# EAGLE design SparkFun BabyBuck Regulator - AP63203 (EAGLE 9.6.2)
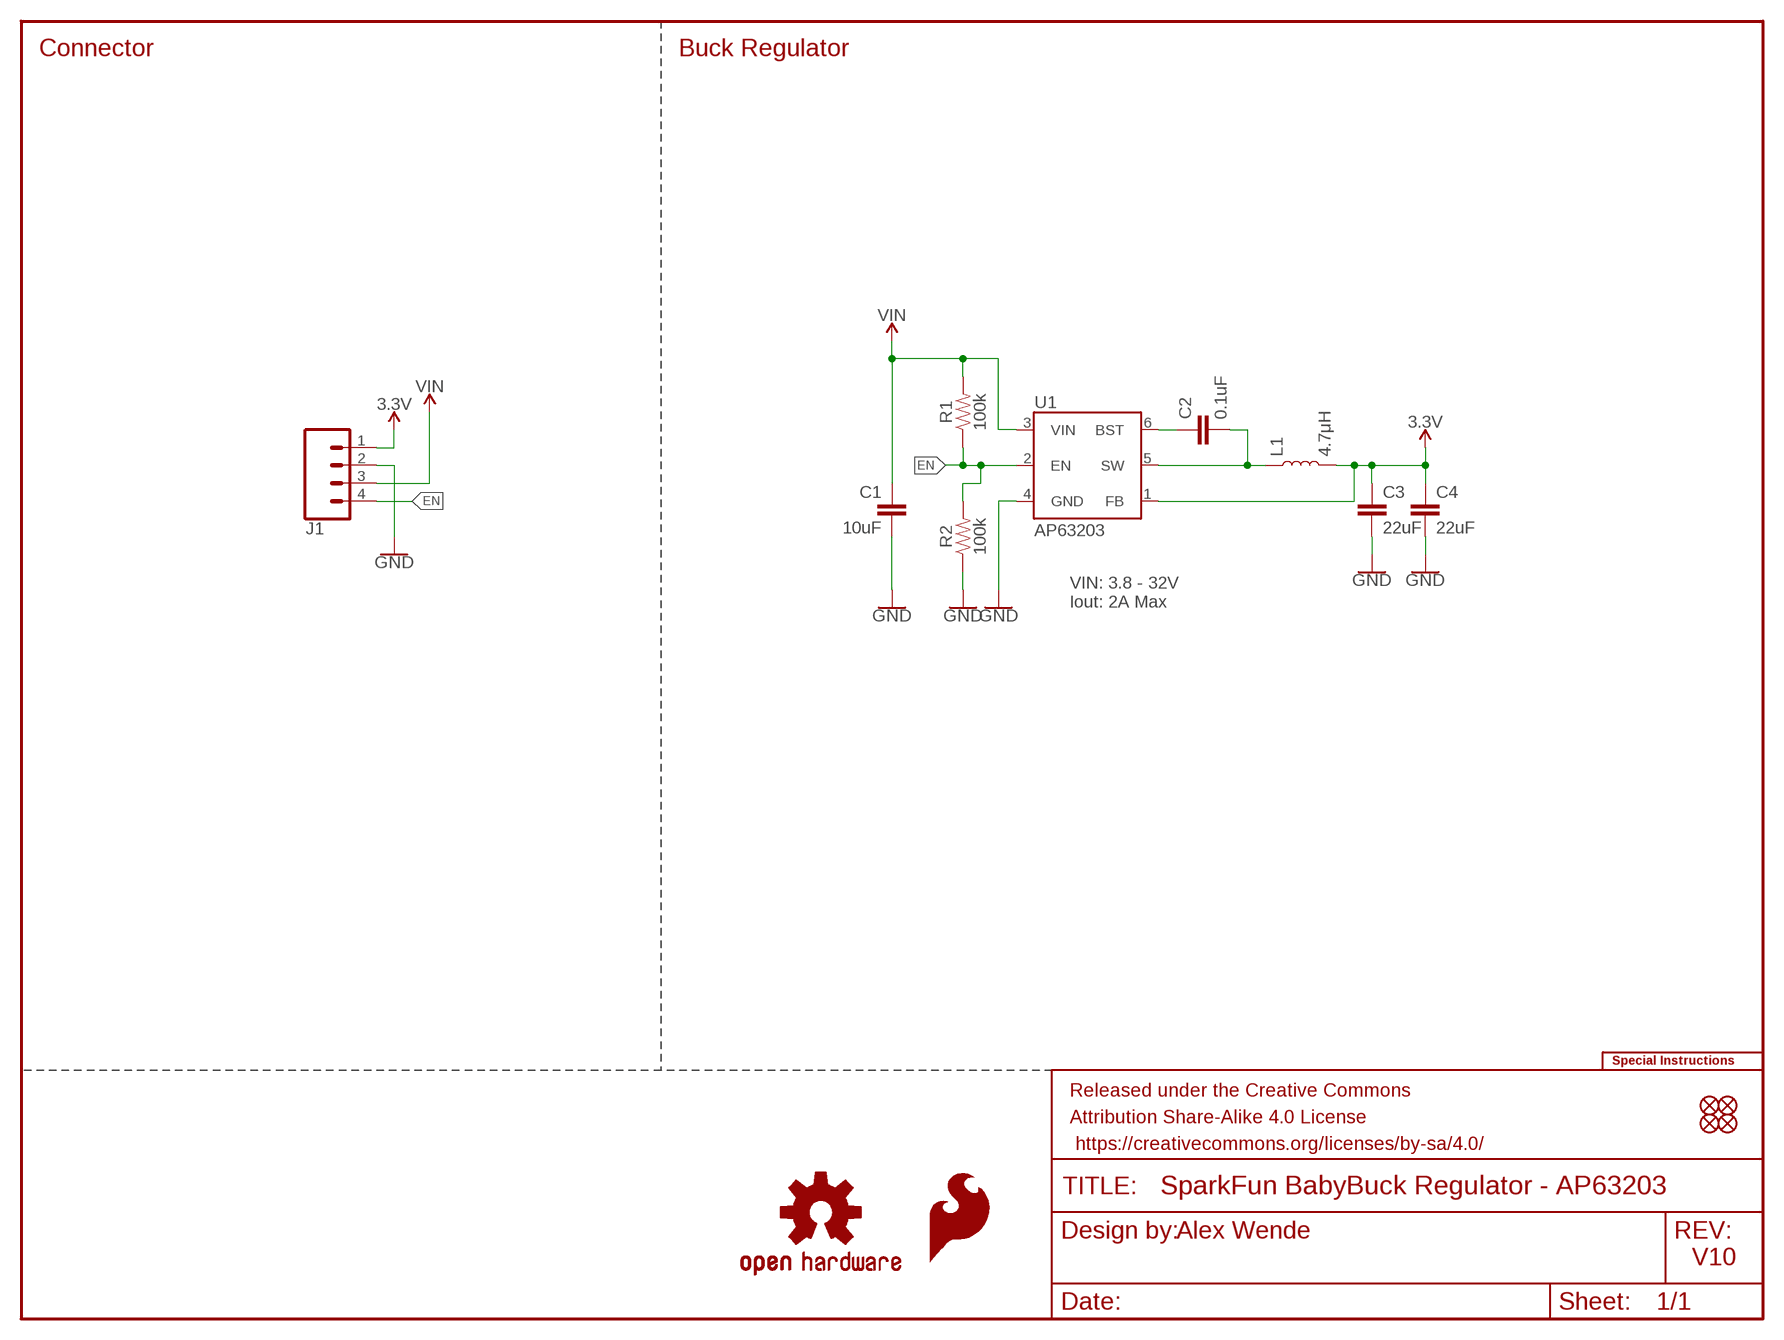
[diagram p0: schematic, sheet 1]

## Parts
C1  10uF  10UF-1210-50V-20%  [1210]
C2  0.1uF  0.1UF-0603-25V-5%  [0603]
C3  22uF  22UF-0603-6.3V-20%  [0603]
C4  22uF  22UF-0603-6.3V-20%  [0603]
FD1  FIDUCIAL0.2MM  [FIDUCIAL-0.2MM]
FD2  FIDUCIAL0.2MM  [FIDUCIAL-0.2MM]
FD3  FIDUCIAL0.2MM  [FIDUCIAL-0.2MM]
FD4  FIDUCIAL0.2MM  [FIDUCIAL-0.2MM]
FRAME1  FRAME-LETTER  [CREATIVE_COMMONS]
J1  CONN_041X04_NO_SILK  [1X04_NO_SILK]
L1  4.7μH  4.7μH_SHIELDED_INDUCTORNPIS_LS  [INDUCTOR_4X4MM]
LOGO1  SFE_LOGO_FLAME.1_INCH  [SFE_LOGO_FLAME_.1]
LOGO2  OSHW-LOGOS  [OSHW-LOGO-S]
LOGO3  SPECIAL_INSTRUCTIONS-ORDERING  [ORDERING_INSTRUCTIONS]
R1  100k  100KOHM-0603-1/10W-1%  [0603]
R2  100k  100KOHM-0603-1/10W-1%  [0603]
U1  AP63203  [SOT23-6]

## Nets
3.3V: C3.1 C4.1 J1.1 L1.P$2 U1.1(FB)
EN: J1.4 R1.1 R2.2 U1.2(EN)
GND: C1.2 C3.2 C4.2 J1.2 R2.1 U1.4(GND)
N$4: C2.1 U1.6(BST)
N$5: C2.2 L1.P$1 U1.5(SW)
VIN: C1.1 J1.3 R1.2 U1.3(VIN)

## Notes on the sheet
- Connector | Buck Regulator
- VIN: 3.8 - 32V
  Iout: 2A Max
- Alex Wende
- V10

## Library data of the parts
C1 = SparkFun-Capacitors:10UF: 10.0µF ceramic capacitors A capacitor is a passive two-terminal electrical component used to store electrical energy temporarily in an electric field.; PROD_ID: CAP-09824
C2 = SparkFun-Capacitors:0.1UF: 0.1µF ceramic capacitors A capacitor is a passive two-terminal electrical component used to store electrical energy temporarily in an electric field.; PROD_ID: CAP-08604
C3 C4 = SparkFun-Capacitors:22UF: 22µF ceramic capacitors A capacitor is a passive two-terminal electrical component used to store electrical energy temporarily in an electric field.; PROD_ID: CAP-14464
FD1-FD4 = SparkFun-Aesthetics:FIDUCIAL: Fiducial Alignment Points Point-of-reference for pick-and-place machines and other optical instruments.
FRAME1 = SparkFun-Aesthetics:FRAME-LETTER: Schematic Frame - Letter Standard 8.5x11 US Letter frame
J1 = SparkFun-Connectors:CONN_04: Multi connection point. Often used as Generic Header-pin footprint for 0.1 inch spaced/style header connections On any of the 0.1 inch spaced packages, you can populate with these: Break Away Headers - Straight <https://www.sparkfun.com/products/116> (PRT-00116) Break Away Male Headers - Right Angle <https://www.sparkfun.com/products/553> (PRT-00553) Female Headers <https://www.sparkfun.com/products/115> (PRT-00115) Break Away Headers - Machine Pin <https://www.sparkfun.com/products/117> (PRT-00117) Break Away Female Headers - Swiss Machine Pin <https://www.sparkfun.com/products/743> (PRT-00743) For SCREWTERMINALS and SPRING TERMINALS visit here: Screw Terimnals on SparkFun.com <https://www.sparkfun.com/search/results?term=Screw+Terminals> (5mm/3.5mm/2.54mm spacing) This device is also useful as a general connection point to wire up your design to another part of your project. Our various solder wires solder well into these plated through hole pads. Hook-Up Wire - Assortment (Stranded, 22 AWG) <https://www.sparkfun.com/products/11375> (PRT-11375) Hook-Up Wire - Assortment (Solid Core, 22 AWG) <https://www.sparkfun.com/products/11367> (PRT-11367) View the entire wire category on our website here <https://www.sparkfun.com/categories/141> Special notes: Molex polarized connector foot print use with SKU : PRT-08231 with associated crimp pins and housings. 1MM SMD Version SKU: PRT-10208; PROD_ID: CONN-09696
L1 = SparkFun-Coils:4.7μH_SHIELDED_INDUCTOR: 4.7uH Inductor 4.7uH 1.4A 50mOhm 1008(2520) Package Shielded; PROD_ID: NDUC-15245
LOGO1 = SparkFun-Aesthetics:SFE_LOGO_FLAME: SparkFun Flame Logo This is the SparkFun flame logo. The logo on the schematic will always be the same size; the package variant is the height of the flame. Default layer for the logo on the board is tSilk.
LOGO2 = SparkFun-Aesthetics:OSHW-LOGO: Open-Source Hardware (OSHW) Logo This logo indicates the piece of hardware it is found on incorporates a OSHW license and/or adheres to the definition of open source hardware found here: http://freedomdefined.org/OSHW
LOGO3 = SparkFun-Aesthetics:SPECIAL_INSTRUCTIONS: Special Ordering/Production Instructions Alert Symbol for special PCB ordering instructions or unique production process warnings. Ordering Instructions Production Instructions Types of information that should be added to box: Copper weight Soldermask color Silk color PCB thickness Number of layers PCB Standard: 1.6mm FR4 1 oz copper immersion silver plating red soldermask white silkscreen Types of information that should be added to box: Special wash requirements Depaneling instructions Humidification Glue curing Default text settings: 0.07 inch 9% ratio 50% line distance
R1 R2 = SparkFun-Resistors:100KOHM: 100kΩ resistor A resistor is a passive two-terminal electrical component that implements electrical resistance as a circuit element. Resistors act to reduce current flow, and, at the same time, act to lower voltage levels within circuits. - Wikipedia; PROD_ID: RES-07828
U1 = SparkFun-IC-Power:AP63203: Diodes Inc. AP63203 3.8V-32V input 3.3V Buck The AP63200/AP63201/AP63203/AP63205 is a 2A, synchronous buck converter with a wide input voltage range of 3.8V to 32V and fully integrates a 125mΩ high-side power MOSFET and a 68mΩ lowside power MOSFET to provide high-efficiency step-down DC/DC conversion; PROD_ID: VREG-15244

## Board
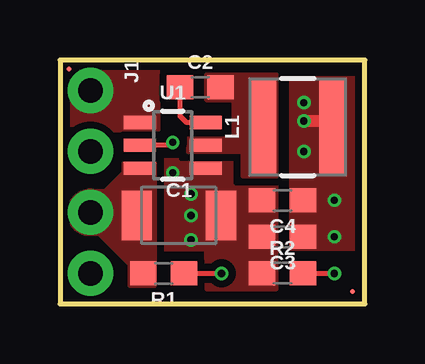
[diagram p1: board, top side]
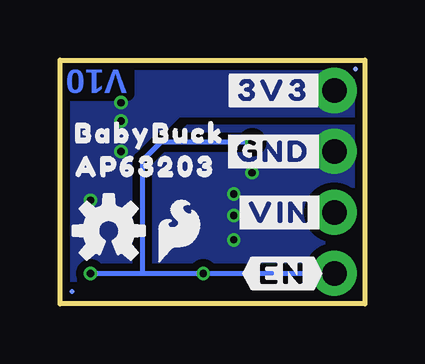
[diagram p2: board, bottom side, seen from below]

Size 12.7 x 10.16 mm. Coordinates in mm from the lower left corner, seen from the top.
Outline: 0,0 12.7,0 12.7,10.16 0,10.16 0,0
Copper layers (1*16): Top 0.035mm / dielectric 1.5mm / Bottom 0.035mm
Design rules "SparkFun-2-Layer-Minimum-JLCPCB": minimum track width 5mil, minimum drill 0.3mm, track to track 5mil, track to pad 5mil, pad to pad 5mil, via to via 5mil, smd to smd 5mil, copper to edge 7mil, drill to drill 7mil, minimum pad ring 5mil, minimum via ring 5mil, stop-mask expansion 2.5mil, vias tented up to drill 25mil, thermal gap 10mil

### Footprints (pad centres in the part's own frame; a part is rotated, then mirrored left to right if it is on the bottom)
1210 = smd 1.27 x 2.06: 1 -1.755,0; 2 1.755,0
0603 = smd 1.1 x 1: 1 -0.85,0; 2 0.85,0
FIDUCIAL-0.2MM = smd 0.2 x 0.2: 1 0,0
1X04_NO_SILK = drill 1.016 pad 1.88: 1 0,0; 2 2.54,0; 3 5.08,0; 4 7.62,0
INDUCTOR_4X4MM = smd 4.089 x 1.143: P$1 0,1.473; P$2 0,-1.473
SOT23-6 = smd 0.55 x 1.35: 1 -0.95,-1.375; 2 0,-1.375; 3 0.95,-1.375; 4 0.95,1.375; 5 0,1.375; 6 -0.95,1.375

### Placement (x,y rotation side)
C1  4.95,3.68 0 top
C2  5.84,9.02 0 top
C3  9.27,2.79 180 top
C4  9.27,4.32 180 top
FD1  12.19,0.51 0 top
FD2  12.19,0.51 0 bottom
FD3  0.38,9.78 0 top
FD4  0.38,9.78 0 bottom
FRAME1  -16.51,-15.24 0 top  (outside the outline)
J1  1.27,8.89 270 top
L1  9.91,7.37 90 top
LOGO1  7.75,3.05 0 bottom
LOGO2  10.67,3.05 0 bottom
LOGO3  24.13,44.45 0 top  (outside the outline)
R1  4.32,1.27 180 top
R2  9.27,1.27 0 top
U1  4.7,6.6 270 top
U$1  [#3V3#0]  3.81,8.89 0 bottom
U$2  [#GND#0]  3.81,6.35 0 bottom
U$3  [#VIN#0]  3.56,3.81 0 bottom
U$4  [#EN#0]  3.43,1.27 0 bottom
U$7  [AP632030]  9.14,5.71 0 bottom
U$8  [BABYBUCK0]  12.7,7.11 0 bottom

### Tracks (layer width: path | path; a pad name or v marks a point on that pad's centre or on a via)
3.3V  (via drill 0.3)
  Top 0.508: v10.16,7.62 11.38,7.62 L1.P$2
  other vias: 10.16,6.35 11.43,4.32 11.43,2.79 10.16,8.38
  pour Top (isolate 0.305, no thermals): 9.65,2.29 9.65,9.4 12.7,9.4 12.7,2.29
  pour Bottom (isolate 0.305, no thermals): 0,10.16 12.7,10.16 12.7,0 9.65,0 9.65,5.97 7.75,7.87 0,7.87
  pour Top (isolate 0.305, no thermals): 0,10.16 4.06,10.16 4.06,7.24 0,7.24
EN  (via drill 0.3)
  Top 0.203: v4.7,6.73 4.57,6.6 U1.2 | R1.1 v6.73,1.27 | R2.2 v11.43,1.27
  Bottom 0.203: J1.4 v6.73,1.27 9.27,1.27 | v4.7,6.73 8.51,6.73 9.27,5.97 9.27,1.27 | v11.43,1.27 9.27,1.27
GND  (via drill 0.3)
  other vias: 4.7,5.46 5.46,4.57 5.46,3.68 5.46,2.67
  pour Top (isolate 0.305, rank 2, no thermals): 4.32,2.29 6.1,2.29 6.1,0.64 9.02,0.64 9.02,5.97 4.32,5.97
  pour Bottom (isolate 0.305, rank 2, no thermals): 0,10.16 12.7,10.16 12.7,0 0,0
N$4
  Top 0.203: U1.6 5.27,7.55 4.99,7.83 C2.1
N$5
  pour Top (isolate 0.305, no thermals): 5.33,6.35 7.62,6.35 7.62,5.33 9.02,5.33 9.02,9.53 6.1,9.53 6.1,8.51 7.24,8.51 7.24,6.86 5.33,6.86
VIN
  pour Top (isolate 0.305, no thermals): 0.38,3.79 arc-90 1.29,4.7 1.91,4.7 2.67,5.46 2.67,5.84 3.94,5.84 3.94,0.76 2.92,0.76 2.92,1.65 1.65,2.92 1.25,2.92 arc-90

### Text on the board
Bottom: V10
tDocu: 2oz copper | Alex Wende